# EAGLE design i2c-level-shifter (EAGLE 7.2.0)
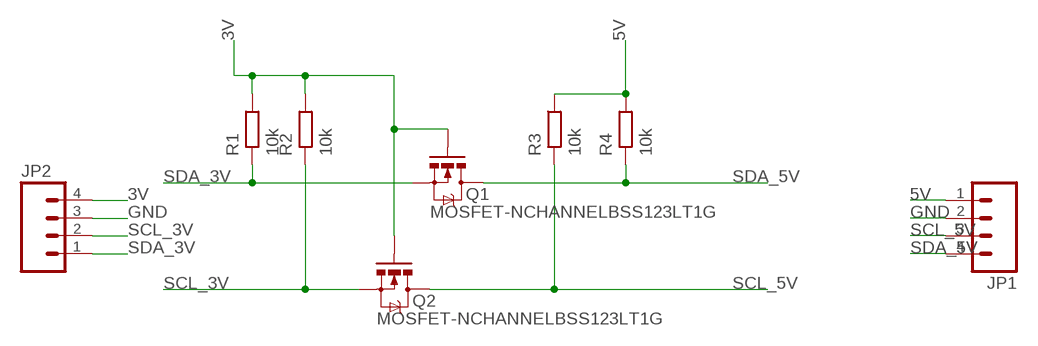
[diagram p0: schematic, sheet 1]

## Parts
JP1  M04LOCK_LONGPADS  [1X04_LOCK_LONGPADS]
JP2  M04LOCK_LONGPADS  [1X04_LOCK_LONGPADS]
Q1  MOSFET-NCHANNELBSS123LT1G  [SOT23]
Q2  MOSFET-NCHANNELBSS123LT1G  [SOT23]
R1  10k  RESISTOR0603-N  [R0603-N]
R2  10k  RESISTOR0603-N  [R0603-N]
R3  10k  RESISTOR0603-N  [R0603-N]
R4  10k  RESISTOR0603-N  [R0603-N]

## Nets
3V: JP2.4 Q1.1(G) Q2.1(G) R1.2 R2.2
5V: JP1.1 R3.2 R4.2
GND: JP1.2 JP2.3
SCL_3V: JP2.2 Q2.2(S) R2.1
SCL_5V: JP1.3 Q2.3(D) R3.1
SDA_3V: JP2.1 Q1.2(S) R1.1
SDA_5V: JP1.4 Q1.3(D) R4.1

## Library data of the parts
JP1 JP2 = SparkFun-Connectors:M04: Header 4 Standard 4-pin 0.1" header. Use with straight break away headers (SKU : PRT-00116), right angle break away headers (PRT-00553), swiss pins (PRT-00743), machine pins (PRT-00117), and female headers (PRT-00115). Molex polarized connector foot print use with SKU : PRT-08231 with associated crimp pins and housings. 1MM SMD Version SKU: PRT-10208; OC_NEWARK: unknown
Q1 Q2 = SparkFun-DiscreteSemi:MOSFET-NCHANNEL: Common NMOSFET Parts MFG P/N Store ID Prod ID FDD8780 TRANS-09984 SI7820DN TRANS-11055 FDS6630A IC-08089 2N7002PW TRANS-11151 FQP30N06L COM-10213 TRANS-10060 BSS123LT1G TRANS-08345 BSS138 TRANS-00830 BS170 2N7000; OC_NEWARK: unknown; PROD_ID: TRANS-08345
R1-R4 = passives-7351:RESISTOR; MF: VISHAY/DALE; MPN: CRCW040210K0FKED; OC_NEWARK: 52K6595

## Board
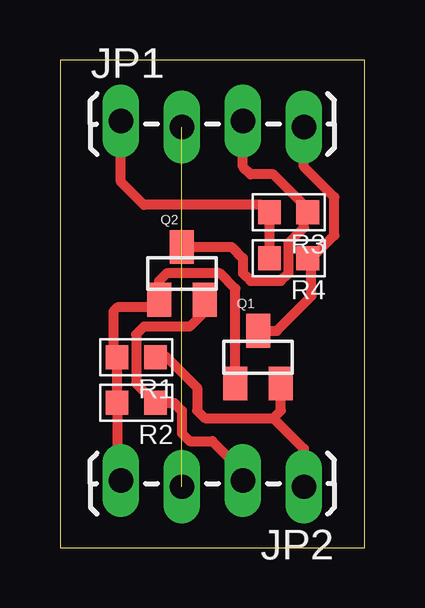
[diagram p1: board, top side]

Size 12.7 x 20.32 mm. Coordinates in mm from the lower left corner, seen from the top.
Outline: 0,0 12.7,0 12.7,20.32 0,20.32 0,0
Copper layers (1*16): Top 0.035mm / dielectric 1.5mm / Bottom 0.035mm
Design rules "default": minimum track width 10mil, minimum drill 24mil, track to track 8mil, track to pad 8mil, pad to pad 8mil, via to via 8mil, smd to smd 8mil, copper to edge 40mil, drill to drill 8mil, minimum pad ring 10mil, minimum via ring 8mil, stop-mask expansion 4mil, vias tented up to drill 0mil, thermal gap 10mil

### Footprints (pad centres in the part's own frame; a part is rotated, then mirrored left to right if it is on the bottom)
1X04_LOCK_LONGPADS = drill 1.016 long: 1 0,0; 2 2.54,-0.254; 3 5.08,0; 4 7.62,-0.254
SOT23 = smd 1 x 1.4: 1 -0.95,-1.1; 2 0.95,-1.1; 3 0,1.1
R0603-N = smd 0.95 x 1: 1 -0.8,0; 2 0.8,0

### Placement (x,y rotation side)
JP1  2.54,17.78 0 top
JP2  10.16,2.54 180 top
Q1  8.26,7.94 0 top
Q2  5.08,11.43 0 top
R1  3.17,7.94 180 top
R2  3.17,6.03 180 top
R3  9.53,13.97 180 top
R4  9.53,12.06 180 top

### Tracks (layer width: path | path; a pad name or v marks a point on that pad's centre or on a via)
3V
  Top 0.406: JP2.4 2.54,3.17 2.38,3.34 R2.2 R1.2 2.22,8.09 2.22,9.84 2.39,10.01 4.13,10.01 Q2.1 4.13,11.11 4.45,11.43 6.67,11.43 7.3,10.79 Q1.1
5V
  Top 0.406: JP1.1 2.54,15.24 3.49,14.29 8.41,14.29 R3.2 R4.2
GND  (1 unrouted)
SCL_3V
  Top 0.406: Q2.2 6.03,9.84 5.4,9.21 3.49,9.21 3.17,8.89 3.17,6.83 R2.1 4.76,6.03 5.08,5.71 5.08,4.76 5.4,4.45 6.35,4.45 7.62,3.17 JP2.2
SCL_5V
  Top 0.406: JP1.3 7.62,15.88 7.94,15.56 8.89,15.56 10.32,14.12 R3.1 10.16,13.8 10.16,13.34 9.53,12.7 9.53,11.43 9.21,11.11 7.94,11.11 7.62,11.43 7.62,12.06 7.16,12.53 Q2.3
SDA_3V
  Top 0.406: 8.89,5.4 6.03,5.4 5.71,5.71 5.71,6.67 4.45,7.94 R1.1 | 8.89,5.4 9.21,5.71 Q1.2 | 8.89,5.4 10.16,4.13 JP2.1
SDA_5V
  Top 0.406: Q1.3 9.04,9.04 10.48,10.48 10.48,11.91 R4.1 10.48,12.06 11.43,13.02 11.43,14.61 10.16,15.88 JP1.4